# Altium project GateDriverProject.PrjPcb
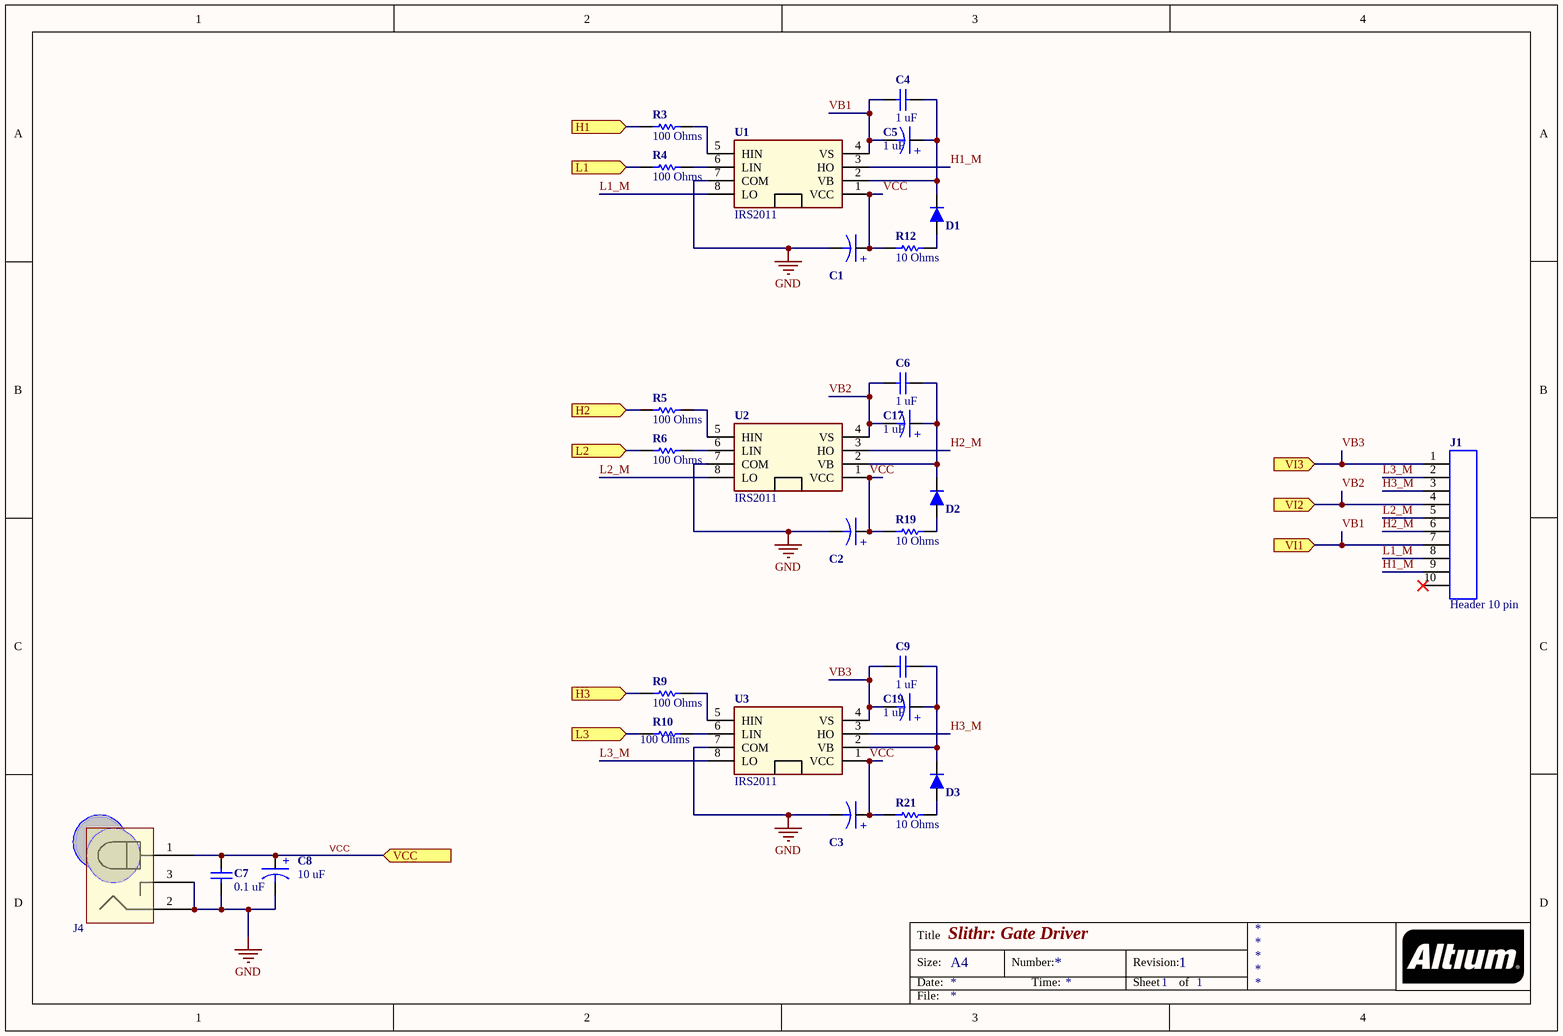
[diagram p0: Gate-Driver.SchDoc]
3 sheets, 85 parts. Net scope: flat (ports and power ports of the same name join across sheets).
Board file: GateDriver_MCU.PcbDoc
Sheets:
  Gate-Driver.SchDoc
  MotorMCU.SchDoc
  MCU-ADDON.SchDoc

## Sheet Gate-Driver.SchDoc: Slithr: Gate Driver
size A4; Date: 12/15/2015; Revision: 1; SheetNumber: 1; SheetTotal: 1

### Parts
C1  (no value)  [CAPMP3528X210N]
C2  (no value)  [CAPMP3528X210N]
C3  (no value)  [CAPMP3528X210N]
C4  1 uF  [CAP-0805(2012)-R]
C5  1 uF  [CAPMP6032X280N]
C6  1 uF  [CAP-0805(2012)-R]
C7  0.1 uF  [CAP-0402(1005)-R]
C8  10 uF  [CAPE5.0mm]
C9  1 uF  [CAP-0805(2012)-R]
C17  1 uF  [CAPMP6032X280N]
C19  1 uF  [CAPMP6032X280N]
D1  (no value)  [DO-214AC]
D2  (no value)  [DO-214AC]
D3  (no value)  [DO-214AC]
J1  Header 10 pin  [HEADER-10-100MIL]
J4  DC_Power-Jack  [Jack_M]  (value not drawn)
R3  100 Ohms  [R-0402(1005)-R]
R4  100 Ohms  [R-0402(1005)-R]
R5  100 Ohms  [R-0402(1005)-R]
R6  100 Ohms  [R-0402(1005)-R]
R9  100 Ohms  [R-0402(1005)-R]
R10  100 Ohms  [R-0402(1005)-R]
R12  10 Ohms  [R-0805(2012)-R]
R19  10 Ohms  [R-0805(2012)-R]
R21  10 Ohms  [R-0805(2012)-R]
U1  IRS2011  [SOIC-8]
U2  IRS2011  [SOIC-8]
U3  IRS2011  [SOIC-8]

### Ports
H1, H2, H3, L1, L2, L3, VCC, VI1, VI2, VI3

### Nets
GND: C1.2(NEGATIVE) C2.2(NEGATIVE) C3.2(NEGATIVE) C7.2 C8.2(NEGATIVE) J4.2(Sleeve) J4.3(Insertion_Detection) U1.7(COM) U2.7(COM) U3.7(COM)
H1_M: J1.9 U1.3(HO)
H2_M: J1.6 U2.3(HO)
H3_M: J1.3 U3.3(HO)
L1_M: J1.8 U1.8(LO)
L2_M: J1.5 U2.8(LO)
L3_M: J1.2 U3.8(LO)
VB1: C4.1 C5.2(NEGATIVE) J1.7 U1.4(VS) ; port VI1
VB2: C6.1 C17.2(NEGATIVE) J1.4 U2.4(VS) ; port VI2
VB3: C9.1 C19.2(NEGATIVE) J1.1 U3.4(VS) ; port VI3
VCC: C1.1(POSITIVE) C2.1(POSITIVE) C3.1(POSITIVE) C7.1 C8.1(POSITIVE) J4.1(Tip) R12.0 R19.0 R21.0 U1.1(VCC) U2.1(VCC) U3.1(VCC) ; port VCC
NetC4_2: C4.2 C5.1(POSITIVE) D1.K(CATHODE) U1.2(VB)
NetC6_2: C6.2 C17.1(POSITIVE) D2.K(CATHODE) U2.2(VB)
NetC9_2: C9.2 C19.1(POSITIVE) D3.K(CATHODE) U3.2(VB)
NetD1_A: D1.A(ANODE) R12.1
NetD2_A: D2.A(ANODE) R19.1
NetD3_A: D3.A(ANODE) R21.1
NetR3_1: R3.1 ; port H1
NetR3_2: R3.2 U1.5(HIN)
NetR4_1: R4.1 ; port L1
NetR4_2: R4.2 U1.6(LIN)
NetR5_1: R5.1 ; port H2
NetR5_2: R5.2 U2.5(HIN)
NetR6_1: R6.1 ; port L2
NetR6_2: R6.2 U2.6(LIN)
NetR9_1: R9.1 ; port H3
NetR9_2: R9.2 U3.5(HIN)
NetR10_1: R10.1 ; port L3
NetR10_2: R10.2 U3.6(LIN)

Not connected (* = marked no-connect by the designer): J1 10*

### Notes on the sheet
- Title
- Size:
- Date:
- A4
- Number:
- Time:
- Revision:
- Sheet
- of
- File:
- (in symbol CAP-1uF-63V-TANTB-TC-C) +
- (in symbol CAP-10uF-25V-ALC) +
- (in symbol CAP-10uF-63V-TANTB-TC-B) +

### Library data of the parts
C1-C3 = CAP-10uF-63V-TANTB-TC-B: CAP TANT, 10uF, 16V, TANT-B; Manufacturer: Vishay / Sprague; Manufacturer Part Number: TP3B106K016C0800AS; Mfr Case Code: B Case; Tolerance: 10 %; ESR: 800 mOhms; Leakage Current: 1.6 uA; Dissipation Factor DF: 6; Ripple Current: 0.33 A; Supplier 1: Mouser; RoHS: RoHS Compliant; Category: Tantalum Capacitors - Solid SMD; Stock 1: 2285; Pricing 1: 1=0.420, 10=0.340, 50=0.268, 100=0.237, 500=0.220, 2000=0.193, 4000=0.180, 10000=0.167, 20000=0.156 (USD); Capacitance: 10 uF; Height: 2.1 mm; Length: 3.5 mm; Operating Temperature Range: - 55 C to + 125 C; Package / Case: 1411 (3528 metric); Packaging: Reel; Product: Tantalum Solid Surface Mounts; Series: TP3; Termination Style: SMD/SMT; Voltage Rating: 16 V; Width: 2.8 mm; Brand: Vishay / Sprague; Case Code - in: 1411; Case Code - mm: 3528; Product Category: Low ESR Solid Tantalum Chip Capacitors; Tradename: TANTAMOUNT; RoHS - Mouser: Y; Minimum Order Quantity: 1; Reeling: True; ComponentLink1URL: http://www.mouser.com/ds/2/427/tp3-240030.pdf; ComponentLink1Description: http://www.mouser.com/ds/2/427/tp3-240030.pdf; Supplier Part Number 1: 74-TP3B106K016C0800A
C4 C6 C9 = CAP- 1 uF- 50 V-CER-0805(2012): CAP CER 1 UF 50V 10% Y5V 0805; Manufacturer: Yageo; Manufacturer Part Number: CC0805KKX7R8BB105; Type: Multilayer Ceramic Chip Capacitor; Voltage Rating DC: 25 VDC; Dielectric: X7R; RoHS: RoHS Compliant By Exemption; Category: Multilayer Ceramic Capacitors MLCC - SMD/SMT; Capacitance: 1 uF; Tolerance: 10 %; Package / Case: 0805 (2012 metric); Supplier 1: Mouser; Stock 1: 45582; Pricing 1: 1=0.120, 10=0.062, 100=0.028, 1000=0.022, 3000=0.017, 9000=0.015, 24000=0.014, 45000=0.013, 99000=0.010 (USD); Height: 1.25 mm; Length: 2 mm; Packaging: Reel; Product: General Type MLCCs; Series: CC; Termination Style: SMD/SMT; Width: 1.25 mm; Brand: Yageo; Case Code - in: 0805; Case Code - mm: 2012; Maximum Operating Temperature: + 125 C; Minimum Operating Temperature: - 55 C; RoHS - Mouser: E; Minimum Order Quantity: 1; Reeling: True; ComponentLink1URL: http://www.mouser.com/ds/2/447/UPY-GP_NP0_16V-to-50V_8-3714.pdf; ComponentLink1Description: http://www.mouser.com/ds/2/447/UPY-GP_NP0_16V-to-50V_8-3714.pdf; Supplier Part Number 1: 603-CC805KKX7R8BB105
C5 C17 C19 = CAP-1uF-63V-TANTB-TC-C: CAP, 1uF, 63V, TANT-B; Manufacturer: AVX; Manufacturer Part Number: TCJC105M063R0300; Mfr Case Code: C Case; Tolerance: 20 %; Type: Tantalum Solid Electrolytic Chip Capacitors  with Conductive Polymer Electrode; Voltage Rating: 63 VDC; ESR: 300 mOhms; Leakage Current: 3.6 uA; Dissipation Factor DF: 6; Supplier 1: Mouser; RoHS: RoHS Compliant; Category: Tantalum Capacitors - Polymer SMD; Stock 1: 984; Pricing 1: 1=1.71, 10=1.41, 100=0.826, 500=0.585, 1000=0.516, 2500=0.465, 10000=0.439, 25000=0.430 (USD); Capacitance: 1 uF; Diameter: -; Height: 2.8 mm; Length: 6 mm; Operating Temperature Range: - 55 C to + 125 C; Package / Case: 2312 (6032 metric); Packaging: Reel; Product: Tantalum Organic Polymer Standard Grade; Series: TCJ; Termination Style: SMD/SMT; Voltage Rating AC: -; Voltage Rating DC: 63 VDC; Width: 3.2 mm; Brand: AVX; Case Code - in: 2312; Case Code - mm: 6032; Maximum Operating Temperature: + 125 C; Minimum Operating Temperature: - 55 C; Product Category: Tantalum Solid Electrolytic Chip Capacitors w Conductive Polymer Electrode; Standard Pack Qty: 500; RoHS - Mouser: Y; Minimum Order Quantity: 1; Reeling: True; ComponentLink1URL: http://www.mouser.com/ds/2/40/tcj-776064.pdf; ComponentLink1Description: http://www.mouser.com/ds/2/40/tcj-776064.pdf; Supplier Part Number 1: 581-TCJC105M063R0300
C7 = CAP- 0.1 uF- 16 V-CER-0402(1005): CAP CER 0.1 UF 16V 5% X7R 0402; Manufacturer: Yageo; Manufacturer Part Number: CC0402KRX7R7BB104; Tolerance: 10 %; Type: Multilayer Ceramic Chip Capacitor; Voltage Rating DC: 16 VDC; Supplier 1: Mouser; RoHS: RoHS Compliant By Exemption; Category: Multilayer Ceramic Capacitors MLCC - SMD/SMT; Stock 1: 655262; Pricing 1: 1=0.100, 10=0.009, 100=0.004, 1000=0.003, 2500=0.002, 10000=0.002 (USD); Capacitance: 0.1 uF; Package / Case: 0402 (1005 metric); Packaging: Reel; Product: General Type MLCCs; Termination Style: SMD/SMT; Brand: Yageo; Case Code - in: 0402; Case Code - mm: 1005; Dielectric: X7R; Maximum Operating Temperature: + 125 C; Minimum Operating Temperature: - 55 C; Standard Pack Qty: 10000; RoHS - Mouser: E; Minimum Order Quantity: 1; Reeling: True; ComponentLink1URL: http://www.mouser.com/ds/2/447/UPY-GPHC_X7R_6.3V-to-50V_8-12304.pdf; ComponentLink1Description: http://www.mouser.com/ds/2/447/UPY-GPHC_X7R_6.3V-to-50V_8-12304.pdf; Supplier Part Number 1: 603-CC402KRX7R7BB104
C8 = CAP-10uF-25V-ALC: CAP, 10uF, 25V, ALC, 20%; Manufacturer: Vishay / Sprague; Manufacturer Part Number: 515D106M025JA6AE3; Voltage Rating DC: 25 VDC; Life: 2000 Hour; Ripple Current: 33 mA; Supplier 1: Mouser; RoHS: RoHS Compliant; Category: Aluminum Electrolytic Capacitors - Leaded; Stock 1: 5463; Pricing 1: 1=0.140, 25=0.137, 100=0.131, 250=0.117, 500=0.102, 1000=0.090, 2000=0.072, 5000=0.071, 10000=0.065 (USD); Capacitance: 10 uF; Diameter: 5 mm; Length: 11 mm; Packaging: Bulk; Product: General Purpose Electrolytic Capacitors; Series: 515D; Termination Style: Radial; Tolerance: 20 %; Brand: Vishay / Sprague; Lead Spacing: 2 mm; Maximum Operating Temperature: + 85 C; Product Category: Radial Aluminum Electrolytic Capacitors - 85 Degree; Standard Pack Qty: 200; RoHS - Mouser: Y; Minimum Order Quantity: 1; Reeling: False; ComponentLink1URL: http://www.mouser.com/ds/2/427/515d-239733.pdf; ComponentLink1Description: http://www.mouser.com/ds/2/427/515d-239733.pdf; Supplier Part Number 1: 75-515D106M025JA6AE3
D1-D3 = DIODE-ES1D: DIODE, ES1D Fairchild; Manufacturer: Fairchild Semiconductor; Configuration: Single; Max Surge Current: 30 A; Recovery Time: 15 ns; If - Forward Current: 1 A; Ir - Reverse Current: 5 uA; Pd - Power Dissipation: 1.47 W; Vf - Forward Voltage: 920 mV; Vr - Reverse Voltage: 200 V; Supplier 1: Mouser; Manufacturer Part Number: ES1D; RoHS: RoHS Compliant By Exemption; Category: Rectifiers; Stock 1: 51841; Pricing 1: 1=0.350, 10=0.227, 100=0.097, 1000=0.075, 2500=0.057, 7500=0.050, 22500=0.047, 45000=0.042, 97500=0.040 (USD); Package / Case: SMA; Packaging: Reel; Product: Ultra Fast Recovery Rectifiers; Series: ES1D; Brand: Fairchild Semiconductor; Mounting Style: SMD/SMT; Maximum Operating Temperature: + 150 C; Minimum Operating Temperature: - 50 C; Standard Pack Qty: 7500; RoHS - Mouser: E; Minimum Order Quantity: 1; Reeling: True; ComponentLink1URL: http://www.mouser.com/ds/2/149/ES1D-888870.pdf; ComponentLink1Description: http://www.mouser.com/ds/2/149/ES1D-888870.pdf; Supplier Part Number 1: 512-ES1D
J1 = CON-10Pin-100Mil: Header, 10pin, .1 pitch; Manufacturer: Molex; Manufacturer Part Number: 90136-1110; Current Rating: 3 A; Mounting Angle: Vertical; Number of Positions: 10 Position; Voltage Rating: 350 VAC/DC; Pitch: 2.54 mm; Latching Type: Latched; Supplier 1: Mouser; RoHS: RoHS Compliant; Category: Headers & Wire Housings; Stock 1: 29; Pricing 1: 1=1.23, 10=1.12, 100=0.916, 500=0.802, 1000=0.687, 2500=0.641, 5000=0.609 (USD); Accessory Type: -; Contact Plating: Tin; Contact Type: -; Housing Material: Polyester; Number of Rows: 1 Row; Packaging: Tray; Product: Headers; Series: 90136; Termination Style: Through Hole; Type: Shrouded; Brand: Molex; Contact Material: Brass; Mounting Style: Straight Pin; Row Spacing: -; Contact Gender: Pin (Male); Product Category: C-Grid Connectors; Standard Pack Qty: 880; Tradename: C-Grid; RoHS - Mouser: Y; Minimum Order Quantity: 1; Reeling: False; ComponentLink1URL: http://www.mouser.com/ds/2/276/0901361110_PCB_HEADERS-176811.pdf; ComponentLink1Description: http://www.mouser.com/ds/2/276/0901361110_PCB_HEADERS-176811.pdf; Supplier Part Number 1: 538-90136-1110
J4 = DC_Power-Jack: Manufacturer: CUI; Manufacturer Part Number: PJ-002B; Connector Type: DC Power Jack; Current Rating: 2.5 A; Inside Contact Diameter: 2.5 mm; Mounting Angle: Right; Outside Contact Diameter: 6.5 mm; Voltage Rating: 16 V; Insulation Resistance: 100 MOhms; Product Status: New at Mouser; Supplier 1: Mouser; RoHS: RoHS Compliant; Category: DC Power Connectors; Stock 1: 6978; Pricing 1: 1=0.930, 10=0.651, 100=0.437, 500=0.353, 1000=0.316, 2500=0.251, 5000=0.247, 10000=0.242, 25000=0.237 (USD); Product: Jacks; Termination Style: Through Hole; Brand: CUI; RoHS - Mouser: Y; Minimum Order Quantity: 1; Reeling: False; ComponentLink1URL: http://www.mouser.com/ds/2/670/pj-002b-515833.pdf; ComponentLink1Description: http://www.mouser.com/ds/2/670/pj-002b-515833.pdf; Supplier Part Number 1: 490-PJ-002B; Contact Plating: Nickel; Housing Material: Polybutylene Terephthalate (PBT); Operating Temperature Range: - 25 C to + 85 C; Contact Material: Copper; Flammability Rating: UL 94 V-0; Mounting Style: Through Hole; Contact Gender: Male
R3-R6 R9 R10 = R-100-62.5 mW-0402(1005): RES 100 OHM 62.5 mW 0402(1005) SMD; Manufacturer: Yageo; Manufacturer Part Number: RC0402FR-07100RL; Power Rating: 62.5 mW (1/16 W); Temperature Coefficient: 100 PPM / C; Tolerance: 1 %; Voltage Rating: 50 V; RoHS: RoHS Compliant; Category: Thick Film Resistors - SMD; Packaging: Reel; Resistance: 100 Ohms; Package / Case: 0402 (1005 metric); Height: 0.35 mm; Supplier 1: Mouser; Stock 1: 353272; Pricing 1: 1=0.100, 10=0.010, 100=0.003, 1000=0.002, 10000=0.001 (USD); Length: 1 mm; Operating Temperature Range: - 55 C to + 155 C; Product: Thick Film Resistors General Purpose; Series: RC; Termination Style: SMD/SMT; Type: General Purpose Chip Resistor Surface Mount; Width: 0.5 mm; Brand: Yageo; Case Code - in: 0402; Case Code - mm: 1005; Product Category: 0402 SMD Chip Resistors; Standard Pack Qty: 10000; RoHS - Mouser: Y; Minimum Order Quantity: 1; Reeling: True; ComponentLink1URL: http://www.mouser.com/ds/2/447/PYu-RC0402_51_RoHS_L_6_r-8721.pdf; ComponentLink1Description: http://www.mouser.com/ds/2/447/PYu-RC0402_51_RoHS_L_6_r-8721.pdf; Supplier Part Number 1: 603-RC0402FR-07100RL
R12 R19 R21 = R-10-125mW-0805: RES 10 OHM 1/8W 0805 SMD; Manufacturer: Yageo; Manufacturer Part Number: RC0805FR-0710RL; Power Rating: 125 mW (1/8 W); Temperature Coefficient: 200 PPM / C; Tolerance: 1 %; Voltage Rating: 150 V; Supplier 1: Mouser; RoHS: RoHS Compliant; Category: Thick Film Resistors - SMD; Stock 1: 46426; Pricing 1: 1=0.100, 10=0.016, 100=0.006, 1000=0.004, 5000=0.003, 25000=0.002 (USD); Height: 0.5 mm; Length: 2 mm; Operating Temperature Range: - 55 C to + 155 C; Package / Case: 0805 (2012 metric); Packaging: Reel; Product: Thick Film Resistors General Purpose; Resistance: 10 Ohms; Series: RC; Termination Style: SMD/SMT; Type: General Purpose Chip Resistor Surface Mount; Width: 1.25 mm; Brand: Yageo; Case Code - in: 0805; Case Code - mm: 2012; Product Category: 0805 SMD Chip Resistors; Standard Pack Qty: 5000; RoHS - Mouser: Y; Minimum Order Quantity: 1; Reeling: True; ComponentLink1URL: http://www.mouser.com/ds/2/447/RC0805-257173.pdf; ComponentLink1Description: http://www.mouser.com/ds/2/447/RC0805-257173.pdf; Supplier Part Number 1: 603-RC0805FR-0710RL
U1-U3 = IRS2011(S)PBF: IC, HS/LS INDEPENDENT DRIVER; Manufacturer: International Rectifier; Manufacturer Part Number: IRS2011SPBF; Configuration: Non-Inverting; Number of Outputs: 2; Output Current: 1 A; Fall Time: 35 ns; Maximum Turn-Off Delay Time: 60 ns; Number of Drivers: 2 Driver; Operating Supply Current: 300 uA; Pd - Power Dissipation: 625 mW; Rise Time: 40 ns; Supply Voltage - Max: 20 V; Supply Voltage - Min: 10 V; Supplier 1: Mouser; RoHS: RoHS Compliant; Category: Gate Drivers; Stock 1: 1172; Pricing 1: 1=2.08, 10=1.77, 100=1.42, 500=1.24, 1000=1.02, 2500=0.955, 5000=0.920, 10000=0.850 (USD); Features: Independent; Package / Case: SOIC-8; Packaging: Tube; Product: Half-Bridge Drivers; Type: High and Low Side Driver; Brand: International Rectifier; Mounting Style: SMD/SMT; Maximum Operating Temperature: + 125 C; Maximum Turn-On Delay Time: 60 ns; Minimum Operating Temperature: - 40 C; Standard Pack Qty: 95; RoHS - Mouser: Y; Minimum Order Quantity: 1; Reeling: False; ComponentLink1URL: http://www.mouser.com/ds/2/200/irs2011pbf-90501.pdf; ComponentLink1Description: http://www.mouser.com/ds/2/200/irs2011pbf-90501.pdf; Supplier Part Number 1: 942-IRS2011SPBF

## Sheet MotorMCU.SchDoc
size A4; Revision: 2
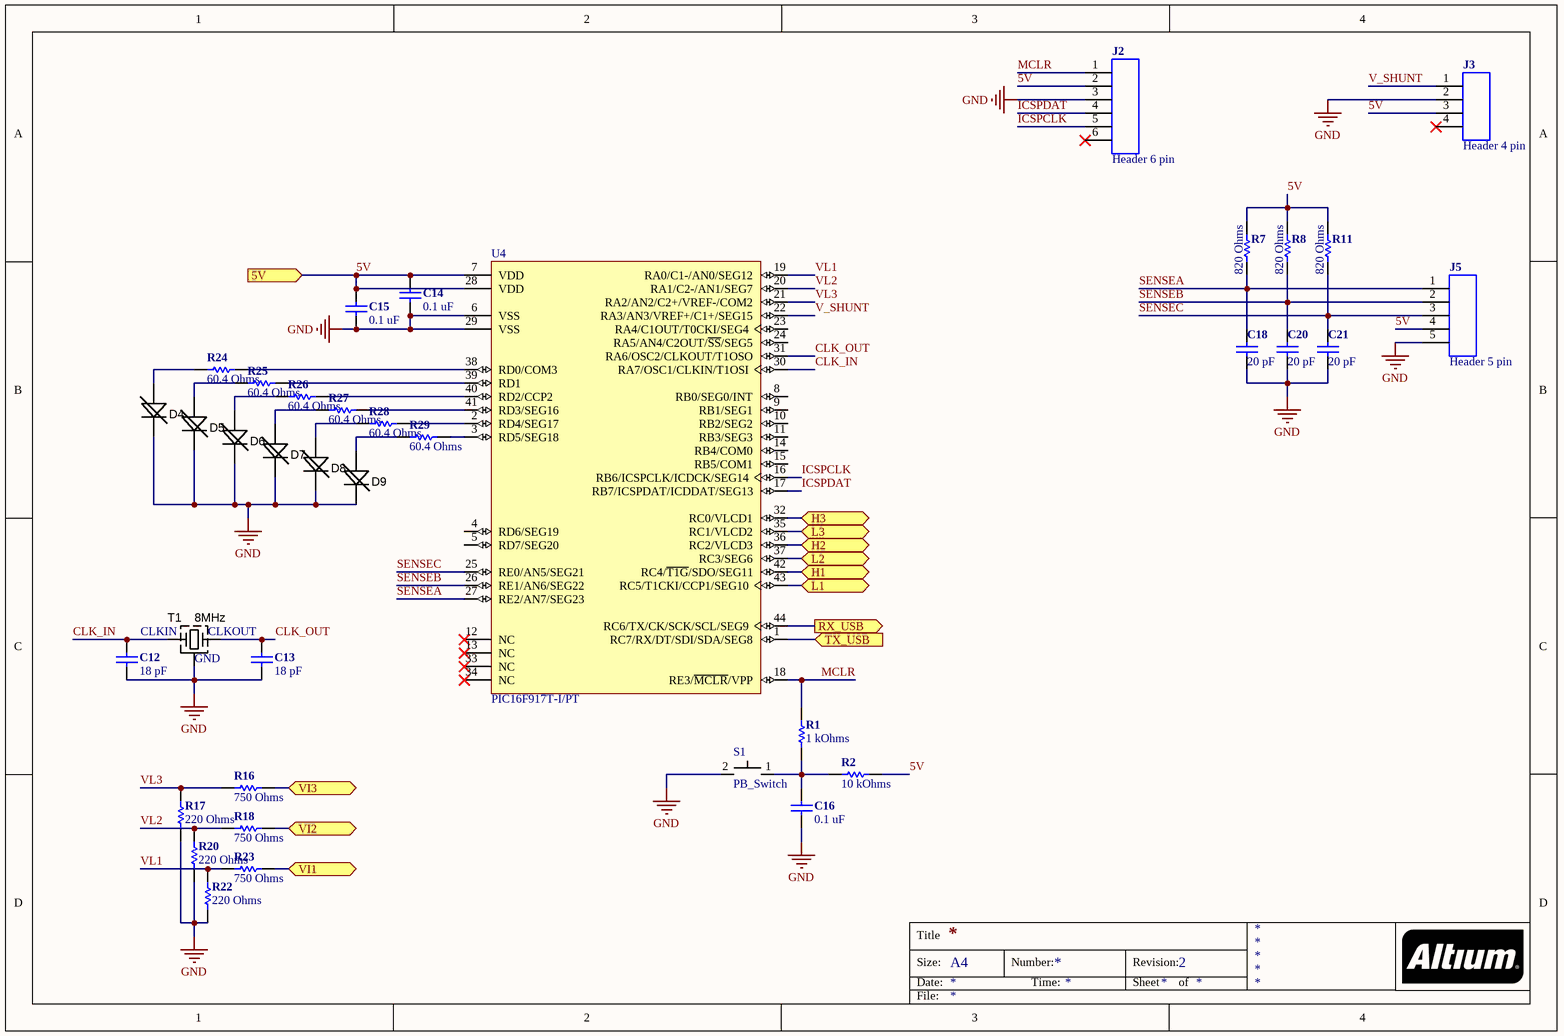
[diagram p1: MotorMCU.SchDoc]

### Parts
C12  18 pF  [CAP-0603(1608)-R]
C13  18 pF  [CAP-0603(1608)-R]
C14  0.1 uF  [CAP-0402(1005)-R]
C15  0.1 uF  [CAP-0402(1005)-R]
C16  0.1 uF  [CAP-0402(1005)-R]
C18  20 pF  [CAP-0402(1005)-R]
C20  20 pF  [CAP-0402(1005)-R]
C21  20 pF  [CAP-0402(1005)-R]
D4  Red  [LED-1206]  (value not drawn)
D5  Red  [LED-1206]  (value not drawn)
D6  Red  [LED-1206]  (value not drawn)
D7  Red  [LED-1206]  (value not drawn)
D8  Red  [LED-1206]  (value not drawn)
D9  Red  [LED-1206]  (value not drawn)
J2  Header 6 pin  [HEADER-6-100mil]
J3  Header 4 pin  [HEADER-4-100mil]
J5  Header 5 pin  [HEADER-5-100mil]
R1  1 kOhms  [R-0402(1005)-R]
R2  10 kOhms  [R-0603(1608)-R]
R7  820 Ohms  [R-0603(1608)-R]
R8  820 Ohms  [R-0603(1608)-R]
R11  820 Ohms  [R-0603(1608)-R]
R16  750 Ohms  [R-0603(1608)-R]
R17  220 Ohms  [R-0603(1608)-R]
R18  750 Ohms  [R-0603(1608)-R]
R20  220 Ohms  [R-0603(1608)-R]
R22  220 Ohms  [R-0603(1608)-R]
R23  750 Ohms  [R-0603(1608)-R]
R24  60.4 Ohms  [R-0603(1608)-R]
R25  60.4 Ohms  [R-0603(1608)-R]
R26  60.4 Ohms  [R-0603(1608)-R]
R27  60.4 Ohms  [R-0603(1608)-R]
R28  60.4 Ohms  [R-0603(1608)-R]
R29  60.4 Ohms  [R-0603(1608)-R]
S1  PB_Switch  [Pushbutton_switches]
T1  8MHz  [CRYSTAL-8MHZ]
U4  PIC16F917T-I/PT  [TQFP-44]

### Ports
5V, H1, H2, H3, L1, L2, L3, RX_USB (out), TX_USB (in), VI1, VI2, VI3

### Nets
GND: C12.2 C13.2 C14.2 C15.2 C16.1 C18.2 C20.2 C21.2 D4.K D5.K D6.K D7.K D8.K D9.K J2.3 J3.2 J5.5 R17.2 R20.2 R22.2 S1.2 T1.2(GND) U4.6(VSS) U4.29(VSS)
5V: C14.1 C15.1 J2.2 J3.3 J5.4 R2.2 R7.1 R8.1 R11.1 U4.7(VDD) U4.28(VDD) ; port 5V
CLK_IN: C12.1 T1.1(CLKIN) U4.30(RA7/OSC1/CLKIN/T1OSI)
CLK_OUT: C13.1 T1.3(X) U4.31(RA6/OSC2/CLKOUT/T1OSO)
ICSPCLK: J2.5 U4.16(RB6/ICSPCLK/ICDCK/SEG14)
ICSPDAT: J2.4 U4.17(RB7/ICSPDAT/ICDDAT/SEG13)
MCLR: J2.1 R1.1 U4.18(RE3/~{MCLR}/VPP)
SENSEA: C18.1 J5.1 R7.2 U4.27(RE2/AN7/SEG23)
SENSEB: C20.1 J5.2 R8.2 U4.26(RE1/AN6/SEG22)
SENSEC: C21.1 J5.3 R11.2 U4.25(RE0/AN5/SEG21)
V_SHUNT: J3.1 U4.22(RA3/AN3/VREF+/C1+/SEG15)
VB1: R23.2 ; port VI1
VB2: R18.2 ; port VI2
VB3: R16.2 ; port VI3
VL1: R22.1 R23.1 U4.19(RA0/C1-/AN0/SEG12)
VL2: R18.1 R20.1 U4.20(RA1/C2-/AN1/SEG7)
VL3: R16.1 R17.1 U4.21(RA2/AN2/C2+/VREF-/COM2)
NetC16_2: C16.2 R1.2 R2.1 S1.1
NetD4_A: D4.A R24.1
NetD5_A: D5.A R25.1
NetD6_A: D6.A R26.1
NetD7_A: D7.A R27.1
NetD8_A: D8.A R28.1
NetD9_A: D9.A R29.1
NetR3_1: U4.42(RC4/~{T1G}/SDO/SEG11) ; port H1
NetR4_1: U4.43(RC5/T1CKI/CCP1/SEG10) ; port L1
NetR5_1: U4.36(RC2/VLCD3) ; port H2
NetR6_1: U4.37(RC3/SEG6) ; port L2
NetR9_1: U4.32(RC0/VLCD1) ; port H3
NetR10_1: U4.35(RC1/VLCD2) ; port L3
NetR24_2: R24.2 U4.38(RD0/COM3)
NetR25_2: R25.2 U4.39(RD1)
NetR26_2: R26.2 U4.40(RD2/CCP2)
NetR27_2: R27.2 U4.41(RD3/SEG16)
NetR28_2: R28.2 U4.2(RD4/SEG17)
NetR29_2: R29.2 U4.3(RD5/SEG18)
NetU4_1: U4.1(RC7/RX/DT/SDI/SDA/SEG8) ; port TX_USB
NetU4_44: U4.44(RC6/TX/CK/SCK/SCL/SEG9) ; port RX_USB

Not connected (* = marked no-connect by the designer): J2 6*; J3 4*; U4 4(RD6/SEG19) 5(RD7/SEG20) 8(RB0/SEG0/INT) 9(RB1/SEG1) 10(RB2/SEG2) 11(RB3/SEG3) 12(NC)* 13(NC)* 14(RB4/COM0) 15(RB5/COM1) 23(RA4/C1OUT/T0CKI/SEG4) 24(RA5/AN4/C2OUT/~{SS}/SEG5) 33(NC)* 34(NC)*

### Notes on the sheet
- Title
- Size:
- Date:
- A4
- Number:
- Time:
- Revision:
- Sheet
- of
- File:
- (in symbol CRYSTAL_8MHz) CLKOUT

### Library data of the parts
C12 C13 = CAP- 18 pF- 25 V-CER-0603(1608): CAP CER 18 pF 10V 5% C0G 0603; Manufacturer: Yageo; Manufacturer Part Number: CC0603FRNPO9BN180; Tolerance: 1 %; Type: Multilayer Ceramic Chip Capacitor; Voltage Rating DC: 50 VDC; Dielectric: C0G (NP0); RoHS: RoHS Compliant By Exemption; Category: Multilayer Ceramic Capacitors MLCC - SMD/SMT; Capacitance: 18 pF; Package / Case: 0603 (1608 metric); Supplier 1: Mouser; Stock 1: 2511; Pricing 1: 1=0.100, 10=0.039, 100=0.027, 1000=0.019, 4000=0.018, 8000=0.017, 24000=0.016, 48000=0.013 (USD); Length: 1.6 mm; Packaging: Reel; Product: General Type MLCCs; Termination Style: SMD/SMT; Width: 0.8 mm; Brand: Yageo; Case Code - in: 0603; Case Code - mm: 1608; Maximum Operating Temperature: + 125 C; Minimum Operating Temperature: - 55 C; RoHS - Mouser: E; Minimum Order Quantity: 1; Reeling: True; ComponentLink1URL: http://www.mouser.com/ds/2/447/UPY-GP_NP0_16V-to-50V_8-3714.pdf; ComponentLink1Description: http://www.mouser.com/ds/2/447/UPY-GP_NP0_16V-to-50V_8-3714.pdf; Supplier Part Number 1: 603-CC603FRNPO9BN180
C14-C16 = CAP- 0.1 uF- 16 V-CER-0402(1005): as C7 on sheet Gate-Driver; Supplier 1: Mouser; RoHS: RoHS Compliant By Exemption; Category: Multilayer Ceramic Capacitors MLCC - SMD/SMT; Stock 1: 655262; Pricing 1: 1=0.100, 10=0.009, 100=0.004, 1000=0.003, 2500=0.002, 10000=0.002 (USD); Capacitance: 0.1 uF; Package / Case: 0402 (1005 metric); Packaging: Reel; Product: General Type MLCCs; Termination Style: SMD/SMT; Brand: Yageo; Case Code - in: 0402; Case Code - mm: 1005; Dielectric: X7R; Maximum Operating Temperature: + 125 C; Minimum Operating Temperature: - 55 C; Standard Pack Qty: 10000; RoHS - Mouser: E; Minimum Order Quantity: 1; Reeling: True; ComponentLink1URL: http://www.mouser.com/ds/2/447/UPY-GPHC_X7R_6.3V-to-50V_8-12304.pdf; ComponentLink1Description: http://www.mouser.com/ds/2/447/UPY-GPHC_X7R_6.3V-to-50V_8-12304.pdf; Supplier Part Number 1: 603-CC402KRX7R7BB104
C18 C20 C21 = CAP- 20 pF- 50 V-CER-0402(1005): CAP CER 20 pF 50V 5% C0G 0402; Manufacturer: Yageo; Manufacturer Part Number: CC0402JRNPO9BN200; Type: Multilayer Ceramic Chip Capacitor; Voltage Rating DC: 50 VDC; Dielectric: C0G (NP0); RoHS: RoHS Compliant By Exemption; Category: Multilayer Ceramic Capacitors MLCC - SMD/SMT; Capacitance: 20 pF; Tolerance: 5 %; Package / Case: 0402 (1005 metric); Supplier 1: Mouser; Stock 1: 75922; Pricing 1: 1=0.100, 10=0.010, 100=0.005, 1000=0.004, 2500=0.003, 10000=0.002 (USD); Length: 1 mm; Packaging: Reel; Product: General Type MLCCs; Termination Style: SMD/SMT; Width: 0.5 mm; Brand: Yageo; Case Code - in: 0402; Case Code - mm: 1005; Maximum Operating Temperature: + 125 C; Minimum Operating Temperature: - 55 C; Standard Pack Qty: 10000; RoHS - Mouser: E; Minimum Order Quantity: 1; Reeling: True; ComponentLink1URL: http://www.mouser.com/ds/2/447/UPY-NP0X7R_MV_100-to-630V_15-594030.pdf; ComponentLink1Description: http://www.mouser.com/ds/2/447/UPY-NP0X7R_MV_100-to-630V_15-594030.pdf; Supplier Part Number 1: 603-CC402JRNPO9BN200
D4-D9 = LED_SMD_RED_0805: LED, 0805 SMD, Red; Manufacturer: Kingbright; Manufacturer Part Number: APTD3216SURCK; Lens Color/Style: Water Clear; LED Size: 3.2 mm x 1.6 mm; Luminous Intensity: 1000 mcd; Viewing Angle: 50 deg; If - Forward Current: 20 mA; Vf - Forward Voltage: 1.95 V; Wavelength/Color Temperature: 630 nm; Package / Case: 1206; Supplier 1: Mouser; RoHS: RoHS Compliant; Category: Standard LEDs - SMD; Stock 1: 52291; Pricing 1: 1=0.270, 10=0.169, 100=0.125, 1000=0.103, 2000=0.092, 10000=0.084, 24000=0.075, 50000=0.071, 100000=0.068 (USD); Illumination Color: Red; Packaging: Reel; Brand: Kingbright; Mounting Style: SMD/SMT; Maximum Operating Temperature: + 85 C; Minimum Operating Temperature: - 40 C; Product Category: LED SMD Super Bright; Standard Pack Qty: 2000; RoHS - Mouser: Y; Minimum Order Quantity: 1; Reeling: True; ComponentLink1URL: http://www.mouser.com/ds/2/216/APTD3216SURCK-65552.pdf; ComponentLink1Description: http://www.mouser.com/ds/2/216/APTD3216SURCK-65552.pdf; Supplier Part Number 1: 604-APTD-3216SURCK
J2 = CON-6Pin-100Mil: Header, 6 pin, .1 pitch; Manufacturer: TE Connectivity / AMP; Manufacturer Part Number: 4-103327-6; Current Rating: 3 A; Mounting Angle: Vertical; Number of Positions: 6 Position; Pitch: 2.54 mm; Insulation Resistance: 5000 MOhms; Mating Post Length: 5.84 mm; Supplier 1: Mouser; Category: Headers & Wire Housings; Stock 1: 9402; Pricing 1: 1=0.230, 25=0.226, 50=0.212, 100=0.198 (USD); Contact Plating: Tin; Housing Material: Thermoplastic; Number of Rows: 1 Row; Operating Temperature Range: - 65 C to + 105 C; Product: Headers; Series: AMPMODU MOD II; Termination Style: Through Hole; Type: Breakaway; Brand: TE Connectivity / AMP; Contact Material: Phosphor Bronze; Flammability Rating: UL 94 V-0; Mounting Style: -; Row Spacing: 2.54 mm; Contact Gender: Pin (Male); Standard Pack Qty: 240; Termination Post Length: 3.05 mm; Tradename: AMPMODU; Minimum Order Quantity: 1; Reeling: False; ComponentLink1URL: http://www.mouser.com/ds/2/418/NG_CD_103327_T_baseFilename-749374.pdf; ComponentLink1Description: http://www.mouser.com/ds/2/418/NG_CD_103327_T_baseFilename-749374.pdf; Supplier Part Number 1: 571-4-103327-6
J3 = CON-4Pin-100Mil: Header, 4 pin, .1 pitch; Manufacturer: Molex; Manufacturer Part Number: 90136-1104; Current Rating: 3 A; Mounting Angle: Vertical; Number of Positions: 4 Position; Voltage Rating: 350 VAC/DC; Pitch: 2.54 mm; Qualification: Commercial; Supplier 1: Mouser; RoHS: RoHS Compliant; Category: Headers & Wire Housings; Stock 1: 2253; Pricing 1: 1=1.17, 10=0.906, 100=0.717, 500=0.646, 1000=0.574, 2000=0.502 (USD); Accessory Type: -; Contact Plating: Tin; Contact Type: -; Housing Material: Polyester; Number of Rows: 1 Row; Packaging: Tray; Product: Headers; Series: 90136; Termination Style: Through Hole; Type: Shrouded; Brand: Molex; Contact Material: Brass; Mounting Style: Straight Pin; Row Spacing: -; Contact Gender: Pin (Male); Product Category: C-Grid Connectors; Standard Pack Qty: 1920; Tradename: C-Grid; RoHS - Mouser: Y; Minimum Order Quantity: 1; Reeling: False; ComponentLink1URL: http://www.mouser.com/ds/2/276/0901361104_PCB_HEADERS-176953.pdf; ComponentLink1Description: http://www.mouser.com/ds/2/276/0901361104_PCB_HEADERS-176953.pdf; Supplier Part Number 1: 538-90136-1104
J5 = CON-5Pin-100Mil: Header, 5 pin, .1 pitch; Manufacturer: Molex; Manufacturer Part Number: 90136-1105; Current Rating: 3 A; Mounting Angle: Vertical; Number of Positions: 5 Position; Voltage Rating: 350 VAC/DC; Pitch: 2.54 mm; Qualification: Commercial; Supplier 1: Mouser; RoHS: RoHS Compliant; Category: Headers & Wire Housings; Stock 1: 2202; Pricing 1: 1=1.17, 10=0.934, 100=0.749, 500=0.675, 1000=0.600, 2000=0.544, 5000=0.525, 10000=0.461 (USD); Accessory Type: -; Contact Plating: Tin; Contact Type: -; Housing Material: Polyester; Number of Rows: 1 Row; Packaging: Tray; Product: Headers; Series: 90136; Termination Style: Through Hole; Type: Shrouded; Brand: Molex; Contact Material: Brass; Mounting Style: Through Hole; Row Spacing: -; Contact Gender: Pin (Male); Product Category: C-Grid Connectors; Standard Pack Qty: 1600; Tradename: C-Grid; RoHS - Mouser: Y; Minimum Order Quantity: 1; Reeling: False; ComponentLink1URL: http://www.mouser.com/ds/2/276/0901361105_PCB_HEADERS-151780.pdf; ComponentLink1Description: http://www.mouser.com/ds/2/276/0901361105_PCB_HEADERS-151780.pdf; Supplier Part Number 1: 538-90136-1105
R1 = R-1K-62.5 mW-0402(1005): RES 1K OHM 62.5 mW 0402(1005) SMD; Manufacturer: Yageo; Manufacturer Part Number: RC0402JR-071KL; Power Rating: 62.5 mW (1/16 W); Temperature Coefficient: 100 PPM / C; Tolerance: 5 %; Voltage Rating: 50 V; RoHS: RoHS Compliant; Category: Thick Film Resistors - SMD; Packaging: Reel; Resistance: 1 kOhms; Package / Case: 0402 (1005 metric); Height: 0.35 mm; Supplier 1: Mouser; Stock 1: 20226; Pricing 1: 1=0.100, 10=0.007, 100=0.002, 2500=0.001, 10000=0.001 (USD); Length: 1 mm; Operating Temperature Range: - 55 C to + 155 C; Product: Thick Film Resistors General Purpose; Series: RC; Termination Style: SMD/SMT; Type: General Purpose Chip Resistor Surface Mount; Width: 0.5 mm; Brand: Yageo; Case Code - in: 0402; Case Code - mm: 1005; Product Category: 0402 SMD Chip Resistors; Standard Pack Qty: 10000; RoHS - Mouser: Y; Minimum Order Quantity: 1; Reeling: True; ComponentLink1URL: http://www.mouser.com/ds/2/447/PYu-RC0402_51_RoHS_L_6_r-8721.pdf; ComponentLink1Description: http://www.mouser.com/ds/2/447/PYu-RC0402_51_RoHS_L_6_r-8721.pdf; Supplier Part Number 1: 603-RC0402JR-071KL
R2 = R-10k-100mW-0603: RES 10k OHM 1/10W 0603 SMD; Manufacturer: Yageo; Manufacturer Part Number: RC0603FR-0710KL; Power Rating: 100 mW; Temperature Coefficient: 100 PPM / C; Tolerance: 1 %; Voltage Rating: 75 V; RoHS: RoHS Compliant; Category: Thick Film Resistors - SMD; Packaging: Reel; Resistance: 10 kOhms; Package / Case: 0603 (1608 metric); Height: 0.45 mm; Supplier 1: Mouser; Stock 1: 240719; Pricing 1: 1=0.100, 10=0.010, 100=0.003, 1000=0.002, 5000=0.002, 10000=0.001 (USD); Length: 1.6 mm; Operating Temperature Range: - 55 C to + 155 C; Product: Thick Film Resistors General Purpose; Series: RC; Termination Style: SMD/SMT; Type: General Purpose Chip Resistor Surface Mount; Width: 0.8 mm; Brand: Yageo; Case Code - in: 0603; Case Code - mm: 1608; Product Category: 0603 SMD Chip Resistors; Standard Pack Qty: 5000; RoHS - Mouser: Y; Minimum Order Quantity: 1; Reeling: True; ComponentLink1URL: http://www.mouser.com/ds/2/447/RC0603-272842.pdf; ComponentLink1Description: http://www.mouser.com/ds/2/447/RC0603-272842.pdf; Supplier Part Number 1: 603-RC0603FR-0710KL
R7 R8 R11 = R-820-100mW-0603(1608): RES 820 OHM 100 mW 0603(1608) SMD; Manufacturer: Yageo; Manufacturer Part Number: RT0603DRD07820RL; Power Rating: 100 mW; Temperature Coefficient: 25 PPM / C; Tolerance: 0.5 %; Voltage Rating: 75 V; RoHS: RoHS Compliant; Category: Thin Film Resistors - SMD; Packaging: Reel; Resistance: 820 Ohms; Package / Case: 0603 (1608 metric); Height: 0.45 mm; Supplier 1: Mouser; Stock 1: 5000; Pricing 1: 1=0.140, 10=0.077, 100=0.027, 1000=0.019, 5000=0.013, 10000=0.012, 25000=0.011, 50000=0.010 (USD); Length: 1.6 mm; Operating Temperature Range: - 55 C to + 125 C; Product: Thin Film Resistors SMD; Series: RT; Termination Style: SMD/SMT; Type: High Precision, High Stability; Width: 0.8 mm; Brand: Yageo; Case Code - in: 0603; Case Code - mm: 1608; RoHS - Mouser: Y; Minimum Order Quantity: 1; Reeling: True; ComponentLink1URL: http://www.mouser.com/ds/2/447/PYu-RT_1-to-0.05_RoHS_L_6-772266.pdf; ComponentLink1Description: http://www.mouser.com/ds/2/447/PYu-RT_1-to-0.05_RoHS_L_6-772266.pdf; Supplier Part Number 1: 603-RT0603DRD07820RL
R16 R18 R23 = R-750-100mW-0603(1608): RES 750 OHM 100 mW 0603(1608) SMD; Manufacturer: Yageo; Manufacturer Part Number: RT0603DRD07750RL; Power Rating: 100 mW; Temperature Coefficient: 25 PPM / C; Tolerance: 0.5 %; Voltage Rating: 75 V; RoHS: RoHS Compliant; Category: Thin Film Resistors - SMD; Packaging: Reel; Resistance: 750 Ohms; Package / Case: 0603 (1608 metric); Height: 0.45 mm; Supplier 1: Mouser; Stock 1: 4747; Pricing 1: 1=0.140, 10=0.077, 100=0.027, 1000=0.019, 5000=0.013, 10000=0.012, 25000=0.011, 50000=0.010 (USD); Length: 1.6 mm; Operating Temperature Range: - 55 C to + 125 C; Product: Thin Film Resistors SMD; Series: RT; Termination Style: SMD/SMT; Type: High Precision, High Stability; Width: 0.8 mm; Brand: Yageo; Case Code - in: 0603; Case Code - mm: 1608; RoHS - Mouser: Y; Minimum Order Quantity: 1; Reeling: True; ComponentLink1URL: http://www.mouser.com/ds/2/447/PYu-RT_1-to-0.05_RoHS_L_6-772266.pdf; ComponentLink1Description: http://www.mouser.com/ds/2/447/PYu-RT_1-to-0.05_RoHS_L_6-772266.pdf; Supplier Part Number 1: 603-RT0603DRD07750RL
R17 R20 R22 = R-220-100 mW-0603(1608): RES 220 OHM 100 mW 0603(1608) SMD; Manufacturer: Yageo; Manufacturer Part Number: RT0603FRE07220RL; Power Rating: 100 mW; Temperature Coefficient: 50 PPM / C; Tolerance: 1 %; Voltage Rating: 75 V; RoHS: RoHS Compliant By Exemption; Category: Thin Film Resistors - SMD; Packaging: Reel; Resistance: 220 Ohms; Package / Case: 0603 (1608 metric); Height: 0.45 mm; Supplier 1: Mouser; Stock 1: 6189; Pricing 1: 1=0.190, 10=0.046, 100=0.015, 1000=0.011, 5000=0.007, 25000=0.006, 50000=0.005 (USD); Length: 1.6 mm; Operating Temperature Range: - 55 C to + 125 C; Product: Thin Film Resistors SMD; Series: RT; Termination Style: SMD/SMT; Type: High Precision, High Stability; Width: 0.8 mm; Brand: Yageo; Case Code - in: 0603; Case Code - mm: 1608; RoHS - Mouser: E; Minimum Order Quantity: 1; Reeling: True; ComponentLink1URL: http://www.mouser.com/ds/2/447/PYu-RT_1-to-0.05_RoHS_L_6-772266.pdf; ComponentLink1Description: http://www.mouser.com/ds/2/447/PYu-RT_1-to-0.05_RoHS_L_6-772266.pdf; Supplier Part Number 1: 603-RT0603FRE07220RL
R24-R29 = R-60.4-100mW-0805: RES 60.4 OHM 100 mW  SMD; Manufacturer: Yageo; Manufacturer Part Number: RC0603FR-0760R4L; Power Rating: 100 mW; Temperature Coefficient: 100 PPM / C; Tolerance: 1 %; Voltage Rating: 75 V; RoHS: RoHS Compliant; Category: Thick Film Resistors - SMD; Packaging: Reel; Resistance: 60.4 Ohms; Package / Case: 0603 (1608 metric); Height: 0.45 mm; Supplier 1: Mouser; Stock 1: 5823; Pricing 1: 1=0.100, 10=0.010, 100=0.003, 1000=0.002, 5000=0.002, 10000=0.001 (USD); Length: 1.6 mm; Operating Temperature Range: - 55 C to + 155 C; Product: Thick Film Resistors General Purpose; Series: RC; Termination Style: SMD/SMT; Type: General Purpose Chip Resistor Surface Mount; Width: 0.8 mm; Brand: Yageo; Case Code - in: 0603; Case Code - mm: 1608; RoHS - Mouser: Y; Minimum Order Quantity: 1; Reeling: True; ComponentLink1URL: http://www.mouser.com/ds/2/447/RC0603-272842.pdf; ComponentLink1Description: http://www.mouser.com/ds/2/447/RC0603-272842.pdf; Supplier Part Number 1: 603-RC0603FR-0760R4L
S1 = PB_Switch: Manufacturer: TE Connectivity / Alcoswitch; Manufacturer Part Number: 2-1437565-8; Actuator: Round; Contact Form: SPST; Current Rating: 50 mA; Illumination: None; Switch Function: OFF - (ON); Voltage Rating DC: 24 VDC; Supplier 1: Mouser; Category: Pushbutton Switches; Stock 1: 18161; Pricing 1: 1=0.140, 10=0.130, 25=0.117, 50=0.108, 100=0.097, 200=0.092, 500=0.087, 1000=0.083 (USD); Contact Plating: Silver; Height: 4.3 mm; Material: Polyamide; Termination Style: Solder Pin; Brand: TE Connectivity / Alcoswitch; Mounting Style: SMD/SMT; Product Category: Pushbutton Switches; Standard Pack Qty: 750; Minimum Order Quantity: 1; Reeling: False; ComponentLink1URL: http://www.mouser.com/ds/2/418/NG_CD_2-1437565-7_V-663783.pdf; ComponentLink1Description: http://www.mouser.com/ds/2/418/NG_CD_2-1437565-7_V-663783.pdf; Supplier Part Number 1: 506-2-1437565-8
T1 = CRYSTAL_8MHz: Oscillator Crystal 8MHz 10ppm; Manufacturer: ABRACON; Manufacturer Part Number: ABMM2-8.000MHZ-E2-T; Type: Ceramic Low Profile Quartz Crystal; Frequency Stability: 20 PPM; Load Capacitance: 18 pF; ESR: 72 Ohms; Package / Case: 6 mm x 3.6 mm; Supplier 1: Mouser; RoHS: RoHS Compliant; Category: Crystals; Stock 1: 13032; Pricing 1: 1=0.930, 10=0.823, 50=0.720, 100=0.650, 200=0.630, 500=0.520, 1000=0.470, 2000=0.460, 5000=0.442 (USD); Frequency: 8 MHz; Height: 1.2 mm; Length: 6 mm; Operating Temperature Range: - 20 C to + 70 C; Packaging: Reel; Series: ABMM2; Termination Style: SMD/SMT; Tolerance: 20 PPM; Width: 3.6 mm; Brand: ABRACON; Mounting Style: SMD/SMT; Product Category: SMD Crystals; Standard Pack Qty: 1000; RoHS - Mouser: Y; Minimum Order Quantity: 1; Reeling: True; ComponentLink1URL: http://www.mouser.com/ds/2/3/ABMM2-40161.pdf; ComponentLink1Description: http://www.mouser.com/ds/2/3/ABMM2-40161.pdf; Supplier Part Number 1: 815-ABMM2-8-E2T
U4 = PIC16F917: Flash-Based, 8-Bit CMOS Microcontroller with LCD Driver and nanoWatt Technology, 8K (x14-Bit words) Program Memory, 608 Bytes Data Memory, 35 I/O pins, 44-Pin TQFP, Standard VDD Range, Industrial Temperature, Tape and Reel; Manufacturer: Microchip Technology; Manufacturer Part Number: PIC16F917-I/PT; Program Memory Type: Flash; Data RAM Size: 352 B; Data RAM Type: RAM; Data ROM Size: 256 B; Data ROM Type: EEPROM; Interface Type: AUSART, I2C, SPI, SSP; Number of I/Os: 35 I/O; Program Memory Size: 14 kB; ADC Resolution: 10 bit; Core: PIC16; Data Bus Width: 8 bit; Maximum Clock Frequency: 20 MHz; Number of ADC Channels: 8; Number of Timers/Counters: 2 Timer; Operating Supply Voltage: 2 V to 5.5 V; PackagingOptionsScrubbed: PIC16F917TIPT; Supply Voltage - Max: 5.5 V; Supply Voltage - Min: 4.5 V; Supplier 1: Mouser; RoHS: RoHS Compliant; Category: 8-bit Microcontrollers - MCU; Stock 1: 160; Pricing 1: 1=3.59, 10=2.99, 25=2.74, 100=2.48 (USD); Package / Case: TQFP-44; Packaging: Tray; Product: MCU; Series: PIC16F917; Brand: Microchip Technology; Mounting Style: SMD/SMT; Maximum Operating Temperature: + 85 C; Minimum Operating Temperature: - 40 C; Processor Series: PIC16; Product Category: PICmicro MCUs; Standard Pack Qty: 160; RoHS - Mouser: Y; Minimum Order Quantity: 1; Reeling: False; ComponentLink1URL: http://www.mouser.com/ds/2/268/41250B-80422.pdf; ComponentLink1Description: http://www.mouser.com/ds/2/268/41250B-80422.pdf; Supplier Part Number 1: 579-PIC16F917-I/PT

## Sheet MCU-ADDON.SchDoc: MCU-Add-On
size A4; Revision: 1
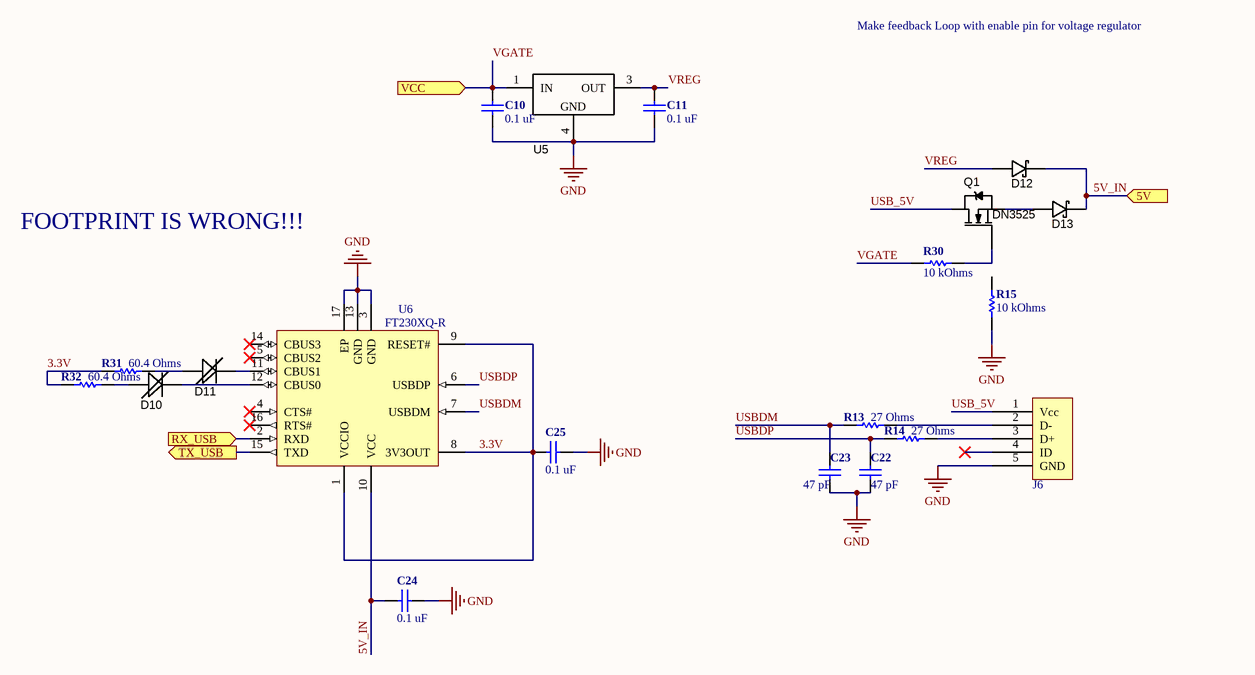
[diagram p2: MCU-ADDON.SchDoc]

### Parts
C10  0.1 uF  [CAP-0402(1005)-R]
C11  0.1 uF  [CAP-0402(1005)-R]
C22  47 pF  [CAP-0603(1608)-R]
C23  47 pF  [CAP-0603(1608)-R]
C24  0.1 uF  [CAP-0402(1005)-R]
C25  0.1 uF  [CAP-0402(1005)-R]
D10  Red  [LED-1206]  (value not drawn)
D11  Red  [LED-1206]  (value not drawn)
D12  MBR120VLSFT3G  [SOD-123FL]  (value not drawn)
D13  MBR120VLSFT3G  [SOD-123FL]  (value not drawn)
J6  USB  [USB_Connector_5P_MICRO_USB_FCI]  (value not drawn)
Q1  DN3525  [SOT89-3]
R13  27 Ohms  [R-0603(1608)-R]
R14  27 Ohms  [R-0603(1608)-R]
R15  10 kOhms  [R-0603(1608)-R]
R30  10 kOhms  [R-0603(1608)-R]
R31  60.4 Ohms  [R-0603(1608)-R]
R32  60.4 Ohms  [R-0603(1608)-R]
U5  FIXED 5V  [TO-252]  (value not drawn)
U6  FT230XQ-R  [QFN-16]

### Ports
5V, RX_USB (in), TX_USB (out), VCC

### Nets
GND: C10.2 C11.2 C22.2 C23.2 C24.2 C25.2 J6.5(GND) R15.1 U5.4(GND) U6.3(GND) U6.13(GND) U6.17(EP)
3.3V: C25.1 R31.1 R32.1 U6.1(VCCIO) U6.8(3V3OUT) U6.9(RESET#)
5V_IN: C24.1 D12.K D13.K U6.10(VCC) ; port 5V  [project net 5V]
USB_5V: J6.1(Vcc) Q1.2(D)
USBDM: C23.1 R13.1 U6.7(USBDM)
USBDP: C22.1 R14.1 U6.6(USBDP)
VGATE: C10.1 R30.1 U5.1(IN) ; port VCC  [project net VCC]
VREG: C11.1 D12.A U5.3(OUT)
NetD10_A: D10.A R32.2
NetD10_K: D10.K U6.12(CBUS0)
NetD11_A: D11.A R31.2
NetD11_K: D11.K U6.11(CBUS1)
NetD13_A: D13.A Q1.3(S)
NetJ6_2: J6.2(D-) R13.2
NetJ6_3: J6.3(D+) R14.2
NetQ1_1: Q1.1(G) R30.2
NetU4_1: U6.15(TXD) ; port TX_USB
NetU4_44: U6.2(RXD) ; port RX_USB

Not connected (* = marked no-connect by the designer): J6 4(ID)*; R15 2; U6 4(CTS#)* 5(CBUS2)* 14(CBUS3)* 16(RTS#)*

### Notes on the sheet
- Make feedback Loop with enable pin for voltage regulator
- FOOTPRINT IS WRONG!!!
- Title
- Size:
- Date:
- A4
- Number:
- Time:
- Revision:
- Sheet
- of
- File:

### Library data of the parts
C10 C11 C24 C25 = CAP- 0.1 uF- 16 V-CER-0402(1005): as C7 on sheet Gate-Driver; Supplier 1: Mouser; RoHS: RoHS Compliant By Exemption; Category: Multilayer Ceramic Capacitors MLCC - SMD/SMT; Stock 1: 655262; Pricing 1: 1=0.100, 10=0.009, 100=0.004, 1000=0.003, 2500=0.002, 10000=0.002 (USD); Capacitance: 0.1 uF; Package / Case: 0402 (1005 metric); Packaging: Reel; Product: General Type MLCCs; Termination Style: SMD/SMT; Brand: Yageo; Case Code - in: 0402; Case Code - mm: 1005; Dielectric: X7R; Maximum Operating Temperature: + 125 C; Minimum Operating Temperature: - 55 C; Standard Pack Qty: 10000; RoHS - Mouser: E; Minimum Order Quantity: 1; Reeling: True; ComponentLink1URL: http://www.mouser.com/ds/2/447/UPY-GPHC_X7R_6.3V-to-50V_8-12304.pdf; ComponentLink1Description: http://www.mouser.com/ds/2/447/UPY-GPHC_X7R_6.3V-to-50V_8-12304.pdf; Supplier Part Number 1: 603-CC402KRX7R7BB104
C22 C23 = CAP- 47 pF- 50 V-CER-0603(1608): CAP CER 47 pF 50V 5% C0G 0603; Manufacturer: Yageo; Manufacturer Part Number: CC0603JRNPO9BN470; Type: Multilayer Ceramic Chip Capacitor; Voltage Rating DC: 50 VDC; Dielectric: C0G (NP0); RoHS: RoHS Compliant; Category: Multilayer Ceramic Capacitors MLCC - SMD/SMT; Capacitance: 47 pF; Tolerance: 5 %; Package / Case: 0603 (1608 metric); Supplier 1: Mouser; Stock 1: 0; Pricing 1: 1=0.100, 10=0.021, 100=0.009, 1000=0.007, 4000=0.005, 48000=0.004, 100000=0.003 (USD); Length: 1.6 mm; Packaging: Reel; Product: General Type MLCCs; Termination Style: SMD/SMT; Width: 0.8 mm; Brand: Yageo; Case Code - in: 0603; Case Code - mm: 1608; Maximum Operating Temperature: + 125 C; Minimum Operating Temperature: - 55 C; Standard Pack Qty: 4000; RoHS - Mouser: E; Minimum Order Quantity: 1; Reeling: True; ComponentLink1URL: http://www.mouser.com/ds/2/447/UPY-GP_NP0_16V-to-50V_8-3714.pdf; ComponentLink1Description: http://www.mouser.com/ds/2/447/UPY-GP_NP0_16V-to-50V_8-3714.pdf; Supplier Part Number 1: 603-CC603JRNPO9BN470
D10 D11 = LED_SMD_RED_0805: as D4 on sheet MotorMCU; Package / Case: 1206; Supplier 1: Mouser; RoHS: RoHS Compliant; Category: Standard LEDs - SMD; Stock 1: 52291; Pricing 1: 1=0.270, 10=0.169, 100=0.125, 1000=0.103, 2000=0.092, 10000=0.084, 24000=0.075, 50000=0.071, 100000=0.068 (USD); Illumination Color: Red; Packaging: Reel; Brand: Kingbright; Mounting Style: SMD/SMT; Maximum Operating Temperature: + 85 C; Minimum Operating Temperature: - 40 C; Product Category: LED SMD Super Bright; Standard Pack Qty: 2000; RoHS - Mouser: Y; Minimum Order Quantity: 1; Reeling: True; ComponentLink1URL: http://www.mouser.com/ds/2/216/APTD3216SURCK-65552.pdf; ComponentLink1Description: http://www.mouser.com/ds/2/216/APTD3216SURCK-65552.pdf; Supplier Part Number 1: 604-APTD-3216SURCK
D12 D13 = DIODE_SCHOTTKY: Diode Schottky SMD 20V 1A SMD; Manufacturer: ON Semiconductor; Configuration: Single; Ifsm - Forward Surge Current: 45 A; Ir - Reverse Current: 600 uA; Vf - Forward Voltage: 0.34 V; Package / Case: SOD-123FL; Supplier 1: Mouser; Supplier Part Number 1: 863-MBR120VLSFT3G; Manufacturer Part Number: MBR120VLSFT3G; RoHS: RoHS Compliant; Category: Schottky Diodes & Rectifiers; Stock 1: 22244; Pricing 1: 1=0.360, 10=0.279, 100=0.151, 1000=0.114, 2500=0.098, 10000=0.091, 20000=0.084, 50000=0.081, 100000=0.076 (USD); Packaging: Reel; Product: Schottky Diodes; Series: MBR120VLSF; Technology: Si; Brand: ON Semiconductor; Mounting Style: SMD/SMT; If - Forward Current: 1 A; Maximum Operating Temperature: + 125 C; Minimum Operating Temperature: - 65 C; Product Category: Diodes- Schottky; Standard Pack Qty: 10000; Vrrm - Repetitive Reverse Voltage: 20 V; RoHS - Mouser: Y; Minimum Order Quantity: 1; Reeling: True; ComponentLink1URL: http://www.mouser.com/ds/2/308/MBR120VLSFT1-D-107081.pdf; ComponentLink1Description: http://www.mouser.com/ds/2/308/MBR120VLSFT1-D-107081.pdf
J6 = USB: USB_Connector_5P_MICRO_USB_FCI; Manufacturer: FCI; Manufacturer Part Number: 10118194-0001LF; Connector Type: Micro USB Type B receptacle; Current Rating: 1.8 A; Gender: Female; Mounting Angle: Right; Number of Contacts: 5 Contact; Insulation Resistance: 1000 MOhms; Supplier 1: Mouser; RoHS: RoHS Compliant; Category: USB Connectors; Stock 1: 17001; Pricing 1: 1=0.410, 10=0.396, 100=0.278, 500=0.238, 1200=0.198, 2400=0.181, 4800=0.170, 9600=0.159, 24000=0.153 (USD); Color: Black; Contact Plating: Gold; Operating Temperature Range: - 55 C to + 85 C; Packaging: Reel; Product: Micro USB Type B Connectors; Termination Style: SMD/SMT; Brand: FCI; Contact Material: Copper Alloy; Flammability Rating: UL 94 V-0; Standard: USB 2.0; Standard Pack Qty: 9600; RoHS - Mouser: Y; Minimum Order Quantity: 1; Reeling: True; ComponentLink1URL: http://www.mouser.com/ds/2/154/10118194AC-197217.pdf; ComponentLink1Description: http://www.mouser.com/ds/2/154/10118194AC-197217.pdf; Supplier Part Number 1: 649-10118194-0001LF
Q1 = DN3525N8-G: MOSFET N-Channel DEPLETION SMD; Manufacturer: Microchip Technology; Configuration: Single; Transistor Type: 1 N-Channel; Number of Channels: 1 Channel; Fall Time: 25 ns; Id - Continuous Drain Current: 360 mA; Pd - Power Dissipation: 1.6 W; Rds On - Drain-Source Resistance: 6 Ohms; Typical Turn-On Delay Time: 20 ns; Vds - Drain-Source Breakdown Voltage: 250 V; Vgs - Gate-Source Voltage: 20 V; Package / Case: SOT-89-3; Supplier 1: Mouser; Supplier Part Number 1: 689-DN3525N8-G; Manufacturer Part Number: DN3525N8-G; RoHS: RoHS Compliant; Category: MOSFET; Stock 1: 34759; Pricing 1: 1=0.720, 10=0.650, 25=0.540, 100=0.490, 2000=0.490 (USD); Packaging: Reel; Brand: Microchip Technology; Mounting Style: SMD/SMT; Transistor Polarity: N-Channel; Channel Mode: Depletion; Maximum Operating Temperature: + 150 C; Minimum Operating Temperature: - 55 C; Product Category: MOSFETs - Depletion Mode N-Channel; Rise Time: 25 ns; Standard Pack Qty: 2000; Typical Turn-Off Delay Time: 25 ns; RoHS - Mouser: Y; Minimum Order Quantity: 1; Reeling: True
R13 R14 = R-27-100 mW-0603: RES 27 OHM 100 mW  SMD; Manufacturer: Yageo; Manufacturer Part Number: RC0603JR-0727RL; Power Rating: 100 mW; Temperature Coefficient: 100 PPM / C; Tolerance: 5 %; Voltage Rating: 75 V; Supplier 1: Mouser; RoHS: RoHS Compliant; Category: Thick Film Resistors - SMD; Stock 1: 21649; Pricing 1: 1=0.100, 10=0.008, 100=0.003, 1000=0.002, 5000=0.002, 50000=0.001 (USD); Height: 0.45 mm; Length: 1.6 mm; Operating Temperature Range: - 55 C to + 155 C; Package / Case: 0603 (1608 metric); Packaging: Reel; Product: Thick Film Resistors General Purpose; Resistance: 27 Ohms; Series: RC; Termination Style: SMD/SMT; Type: General Purpose Chip Resistor Surface Mount; Width: 0.8 mm; Brand: Yageo; Case Code - in: 0603; Case Code - mm: 1608; Product Category: 0603 SMD Chip Resistors; Standard Pack Qty: 5000; RoHS - Mouser: Y; Minimum Order Quantity: 1; Reeling: True; ComponentLink1URL: http://www.mouser.com/ds/2/447/RC0603-272842.pdf; ComponentLink1Description: http://www.mouser.com/ds/2/447/RC0603-272842.pdf; Supplier Part Number 1: 603-RC0603JR-0727RL
R15 R30 = R-10k-100mW-0603: as R2 on sheet MotorMCU; RoHS: RoHS Compliant; Category: Thick Film Resistors - SMD; Packaging: Reel; Resistance: 10 kOhms; Package / Case: 0603 (1608 metric); Height: 0.45 mm; Supplier 1: Mouser; Stock 1: 240719; Pricing 1: 1=0.100, 10=0.010, 100=0.003, 1000=0.002, 5000=0.002, 10000=0.001 (USD); Length: 1.6 mm; Operating Temperature Range: - 55 C to + 155 C; Product: Thick Film Resistors General Purpose; Series: RC; Termination Style: SMD/SMT; Type: General Purpose Chip Resistor Surface Mount; Width: 0.8 mm; Brand: Yageo; Case Code - in: 0603; Case Code - mm: 1608; Product Category: 0603 SMD Chip Resistors; Standard Pack Qty: 5000; RoHS - Mouser: Y; Minimum Order Quantity: 1; Reeling: True; ComponentLink1URL: http://www.mouser.com/ds/2/447/RC0603-272842.pdf; ComponentLink1Description: http://www.mouser.com/ds/2/447/RC0603-272842.pdf; Supplier Part Number 1: 603-RC0603FR-0710KL
R31 R32 = R-60.4-100mW-0805: as R24 on sheet MotorMCU; RoHS: RoHS Compliant; Category: Thick Film Resistors - SMD; Packaging: Reel; Resistance: 60.4 Ohms; Package / Case: 0603 (1608 metric); Height: 0.45 mm; Supplier 1: Mouser; Stock 1: 5823; Pricing 1: 1=0.100, 10=0.010, 100=0.003, 1000=0.002, 5000=0.002, 10000=0.001 (USD); Length: 1.6 mm; Operating Temperature Range: - 55 C to + 155 C; Product: Thick Film Resistors General Purpose; Series: RC; Termination Style: SMD/SMT; Type: General Purpose Chip Resistor Surface Mount; Width: 0.8 mm; Brand: Yageo; Case Code - in: 0603; Case Code - mm: 1608; RoHS - Mouser: Y; Minimum Order Quantity: 1; Reeling: True; ComponentLink1URL: http://www.mouser.com/ds/2/447/RC0603-272842.pdf; ComponentLink1Description: http://www.mouser.com/ds/2/447/RC0603-272842.pdf; Supplier Part Number 1: 603-RC0603FR-0760R4L
U5 = MC78M05CDTRKG: Voltage Regulator IC, DPAK SMD, MC78M05CDTRKG; Manufacturer: ON Semiconductor; Input Voltage MAX: 35 V; Number of Outputs: 1; Output Current: 500 mA; PSRR / Ripple Rejection - Typ: 80 dB; Input Voltage MIN: 7 V; Line Regulation: 50 mV; Load Regulation: 100 mV; Polarity: Positive; Package / Case: TO-252-3 (DPAK); Supplier 1: Mouser; Supplier Part Number 1: 863-MC78M05CDTRKG; Manufacturer Part Number: MC78M05CDTRKG; RoHS: RoHS Compliant; Category: Linear Voltage Regulators; Stock 1: 26245; Pricing 1: 1=0.470, 10=0.353, 100=0.222, 1000=0.166, 2500=0.142, 10000=0.132, 25000=0.125, 50000=0.119, 100000=0.116 (USD); Output Type: Fixed; Output Voltage: 5 V; Packaging: Reel; Series: MC78M05; Brand: ON Semiconductor; Mounting Style: SMD/SMT; Maximum Operating Temperature: + 125 C; Minimum Operating Temperature: 0 C; Product Category: Linear Regulators- General Purpose; Standard Pack Qty: 2500; RoHS - Mouser: Y; Minimum Order Quantity: 1; Reeling: True; ComponentLink1URL: http://www.mouser.com/ds/2/308/MC78M00-D-88441.pdf; ComponentLink1Description: http://www.mouser.com/ds/2/308/MC78M00-D-88441.pdf
U6 = FT230XQ-R: USB to Basic UART Interface Chip, UHCI/OHCI/EHCI Compatible, USB 2.0 Compatible, -40 to +85 degC, 16-Pin QFN, Pb-Free, Tape and Reel; Manufacturer: FTDI; Data Rate: 480 Mb/s, 12 Mb/s; Speed: High-Speed; Interface Type: UART, USB; Operating Supply Current: 6.5 mA to 8.3 mA; Operating Supply Voltage: 2.97 V to 5.5 V; PackagingOptionsScrubbed: FT230XQT; ComponentLink1Description: http://www.mouser.com/ds/2/163/DS_FT230X-5395.pdf; ComponentLink1URL: http://www.mouser.com/ds/2/163/DS_FT230X-5395.pdf; Supplier 1: Mouser; Manufacturer Part Number: FT230XQ-R; RoHS: RoHS Compliant; Category: USB Interface IC; Stock 1: 69254; Pricing 1: 1=2.04, 25=1.97, 100=1.90, 250=1.71, 500=1.54, 1000=1.46, 2500=1.38, 5000=1.38 (USD); Package / Case: QFN-16; Packaging: Reel; Product: USB Bridge Controllers; Series: FT230; Type: Bridge, USB to UART; Brand: FTDI; Mounting Style: SMD/SMT; Maximum Operating Temperature: + 85 C; Standard: USB 2.0; Standard Pack Qty: 5000; Tradename: X-Chip; RoHS - Mouser: Y; Minimum Order Quantity: 1; Reeling: True; Supplier Part Number 1: 895-FT230XQ-R

## Nets that join several sheets
GND: Gate-Driver (10 pins), MotorMCU (24 pins), MCU-ADDON (12 pins)
5V: MotorMCU (11 pins), MCU-ADDON (C24.1 D12.K D13.K U6.10)
NetR3_1: Gate-Driver (R3.1), MotorMCU (U4.42)
NetR4_1: Gate-Driver (R4.1), MotorMCU (U4.43)
NetR5_1: Gate-Driver (R5.1), MotorMCU (U4.36)
NetR6_1: Gate-Driver (R6.1), MotorMCU (U4.37)
NetR9_1: Gate-Driver (R9.1), MotorMCU (U4.32)
NetR10_1: Gate-Driver (R10.1), MotorMCU (U4.35)
NetU4_1: MotorMCU (U4.1), MCU-ADDON (U6.15)
NetU4_44: MotorMCU (U4.44), MCU-ADDON (U6.2)
VB1: Gate-Driver (C4.1 C5.2 J1.7 U1.4), MotorMCU (R23.2)
VB2: Gate-Driver (C6.1 C17.2 J1.4 U2.4), MotorMCU (R18.2)
VB3: Gate-Driver (C9.1 C19.2 J1.1 U3.4), MotorMCU (R16.2)
VCC: Gate-Driver (12 pins), MCU-ADDON (C10.1 R30.1 U5.1)